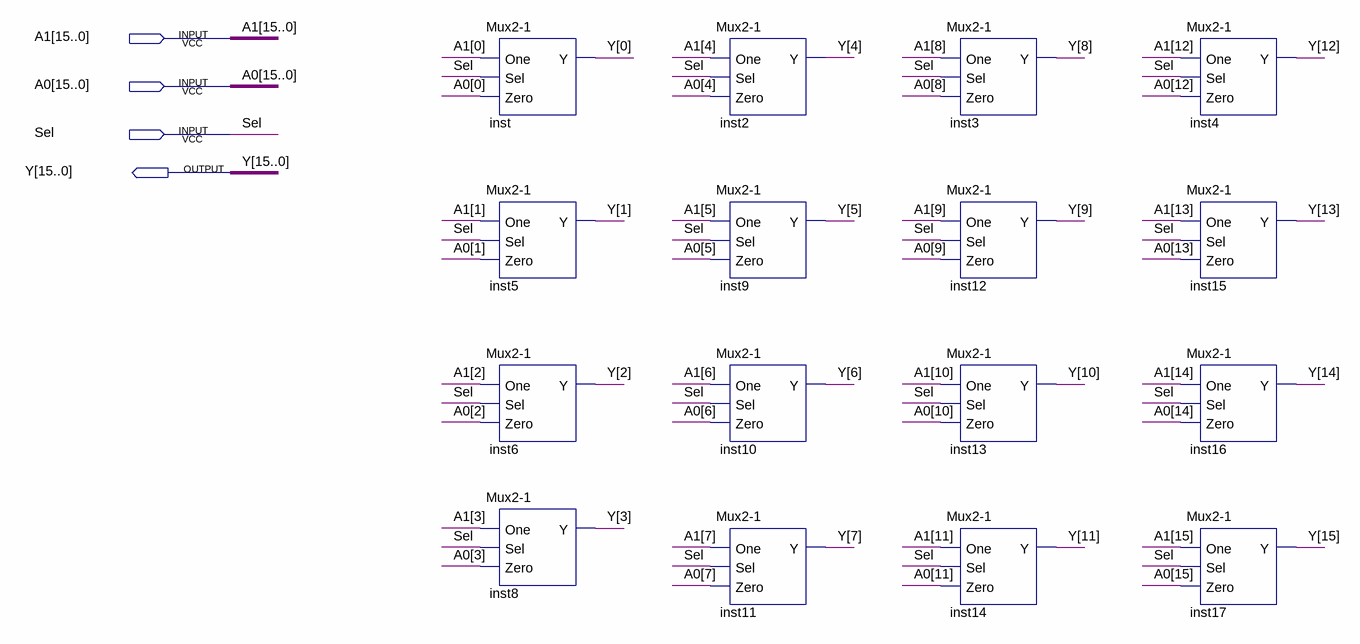
[diagram p0: schematic sheet]
// Quartus schematic Mux2-1-16bits.bdf as structural Verilog: 16 symbols, 4 pins
module \Mux2-1-16bits  (
  input  [15:0] A1,
  input  [15:0] A0,
  input  Sel,
  output [15:0] Y
);

  \Mux2-1  inst (.One(A1[0]), .Sel(Sel), .Zero(A0[0]), .Y(Y[0]));
  \Mux2-1  inst5 (.One(A1[1]), .Sel(Sel), .Zero(A0[1]), .Y(Y[1]));
  \Mux2-1  inst6 (.One(A1[2]), .Sel(Sel), .Zero(A0[2]), .Y(Y[2]));
  \Mux2-1  inst8 (.One(A1[3]), .Sel(Sel), .Zero(A0[3]), .Y(Y[3]));
  \Mux2-1  inst2 (.One(A1[4]), .Sel(Sel), .Zero(A0[4]), .Y(Y[4]));
  \Mux2-1  inst9 (.One(A1[5]), .Sel(Sel), .Zero(A0[5]), .Y(Y[5]));
  \Mux2-1  inst10 (.One(A1[6]), .Sel(Sel), .Zero(A0[6]), .Y(Y[6]));
  \Mux2-1  inst11 (.One(A1[7]), .Sel(Sel), .Zero(A0[7]), .Y(Y[7]));
  \Mux2-1  inst3 (.One(A1[8]), .Sel(Sel), .Zero(A0[8]), .Y(Y[8]));
  \Mux2-1  inst12 (.One(A1[9]), .Sel(Sel), .Zero(A0[9]), .Y(Y[9]));
  \Mux2-1  inst13 (.One(A1[10]), .Sel(Sel), .Zero(A0[10]), .Y(Y[10]));
  \Mux2-1  inst14 (.One(A1[11]), .Sel(Sel), .Zero(A0[11]), .Y(Y[11]));
  \Mux2-1  inst4 (.One(A1[12]), .Sel(Sel), .Zero(A0[12]), .Y(Y[12]));
  \Mux2-1  inst15 (.One(A1[13]), .Sel(Sel), .Zero(A0[13]), .Y(Y[13]));
  \Mux2-1  inst16 (.One(A1[14]), .Sel(Sel), .Zero(A0[14]), .Y(Y[14]));
  \Mux2-1  inst17 (.One(A1[15]), .Sel(Sel), .Zero(A0[15]), .Y(Y[15]));
endmodule
